# Altium project dental-unit-AS5600 v1_0.PrjPCB
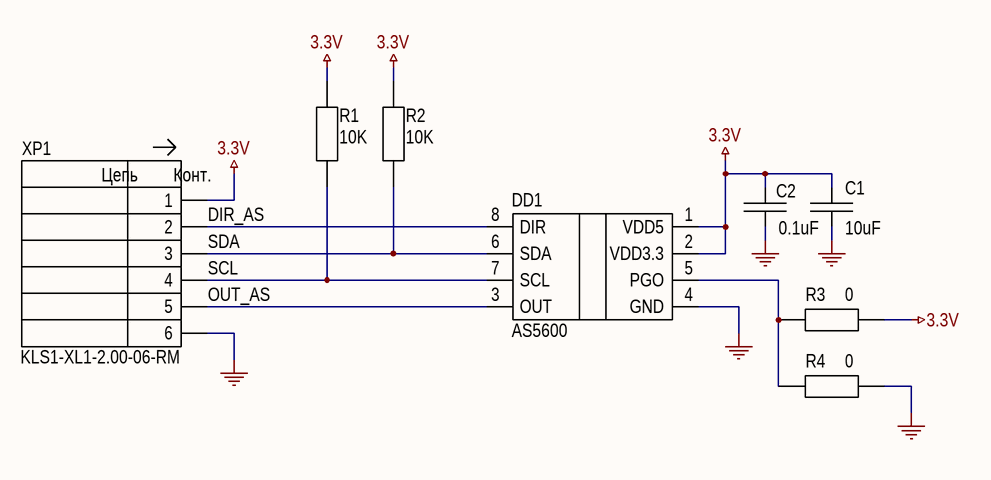
[diagram p0: dental-unit-AS5600 v1_0.SchDoc]
1 sheet, 8 parts. Net scope: global (net labels, ports and power ports of the same name join across sheets).
Board file: dental-unit-AS5600 v1_0.PcbDoc

## Sheet dental-unit-AS5600 v1_0.SchDoc
size 420 x 297 mm

### Parts
C1  value 10uF  [CC_0603]  (hidden comment: CL10A106KP8NNNC)
C2  value 0.1uF  [CC_0603]  (hidden comment: CC0603KRX7R5BB104)
DD1  AS5600  [SOIC-8]
R1  value 10K  [RC_0603]  (hidden comment: AC0603FR-0710KL)
R2  value 10K  [RC_0603]  (hidden comment: AC0603FR-0710KL)
R3  value 0  [RC_0603]  (hidden comment: AC0603FR-070RL)
R4  value 0  [RC_0603]  (hidden comment: AC0603FR-070RL)
XP1  KLS1-XL1-2.00-06-RM  [KLS1-XL1-2.00-06-RM]

### Nets
3.3V: C1.2 C2.2 DD1.1(VDD5) DD1.2(VDD3.3) R1.2 R2.2 R3.2 XP1.1
GND: C1.1 C2.1 DD1.4(GND) R4.2 XP1.6
DIR_AS: DD1.8(DIR) XP1.2
OUT_AS: DD1.3(OUT) XP1.5
SCL: DD1.7(SCL) R1.1 XP1.4
SDA: DD1.6(SDA) R2.1 XP1.3
NetDD1_5: DD1.5(PGO) R3.1 R4.1

### Notes on the sheet
- Перв. примен.
- Справ. №
- Подп. и дата
- Инв. № дубл.
- Взам. инв. №
- Разраб.
- Изм.
- Лист
- № докум.
- Подп.
- Дата
- Лит.
- Масса
- Масштаб
- Пров.
- Т.контр.
- Листов
- Инв. № подл.
- Утв.
- Н.контр.
- 2.106-A3
- Копировал
- Формат А3
- (in symbol KLS1-XL1-2.00-06-x) Цепь; Конт.

### Library data of the parts
C1 = C: Cap Ceramic, 0603, 10u, 10%, 16V, X5R (Sumsung); type: CL10A106KP8NNNC
C2 = C: Cap Ceramic, 0603, 0.1u, 10%, 16V, X7R (Yageo); type: CC0603KRX7R5BB104
DD1 = AS5600: 12-Bit Programmable Contactless / Potentiometer; type: AS5600; ComponentLink1Description: datasheet; ComponentLink1URL: https://ams.com/documents/20143/36005/AS5600_DS000365_5-00.pdf
R1 R2 = R: Res, 0603, 10K, 1%, 0.25W (ф. Yageo); type: AC0603FR-0710KL; power: 0.25W
R3 R4 = R: Res, 0603, 0, 1%, 0.25W (ф. Yageo); type: AC0603FR-070RL; power: 0.25W
XP1 = KLS1-XL1-2.00-06-x: 2.0mm, 6pin, KLS; name: nane; ComponentLink1Description: link; ComponentLink1URL: https://klsele.com/admin/product_upload/20220615100315L-KLS1-XL1-2.00.pdf